# EAGLE schematic pure_midi (EAGLE 9.2.2)

## Sheet 1 of 6: CONTROLLER
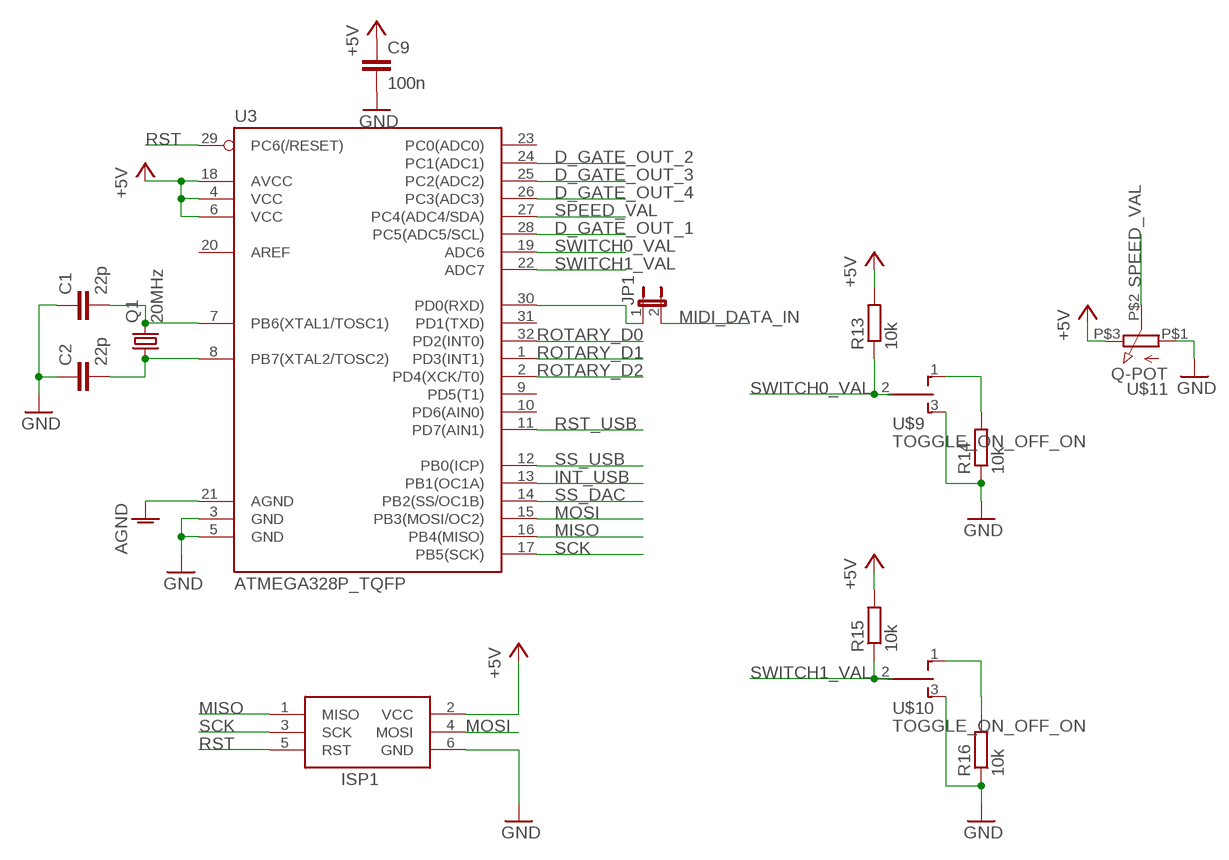
[diagram p0: schematic, sheet 1]

### Parts
C1  22p  C-EUC0805  [C0805]
C2  22p  C-EUC0805  [C0805]
C9  100n  C-EUC0805  [C0805]
ISP1  AVRISP-6  [AVRISP]
JP1  JP1E  [JP1]
Q1  20MHz  CRYSTALHC49UP  [HC49UP]
R13  10k  R-EU_R0805  [R0805]
R14  10k  R-EU_R0805  [R0805]
R15  10k  R-EU_R0805  [R0805]
R16  10k  R-EU_R0805  [R0805]
U3  ATMEGA328P_TQFP  [TQFP32-08]
U$9  TOGGLE_ON_OFF_ON  [TOGGLE_ON_OFF_ON]
U$10  TOGGLE_ON_OFF_ON  [TOGGLE_ON_OFF_ON]
U$11  Q-POT  [Q-POT]

### Nets
+5V [POWER]: C9.1 ISP1.2(VCC) R13.2 R15.2 U3.4(VCC) U3.6(VCC) U3.18(AVCC) U$11.P$3 ; also sheet 2,3,4,5,6
D_GATE_OUT_1: U3.28(PC5(ADC5/SCL)) ; also sheet 2
D_GATE_OUT_2: U3.24(PC1(ADC1)) ; also sheet 2
D_GATE_OUT_3: U3.25(PC2(ADC2)) ; also sheet 2
D_GATE_OUT_4: U3.26(PC3(ADC3)) ; also sheet 2
GND [POWER]: C1.1 C2.1 C9.2 ISP1.6(GND) R14.1 R16.1 U3.3(GND) U3.5(GND) U3.21(AGND) U$9.3(S) U$10.3(S) U$11.P$1 ; supply symbol labelled AGND ; also sheet 2,3,4,5,6
INT_USB: U3.13(PB1(OC1A)) ; also sheet 5
MIDI_DATA_IN: JP1.2 ; also sheet 3
MISO: ISP1.1(MISO) U3.16(PB4(MISO)) ; also sheet 5
MOSI: ISP1.4(MOSI) U3.15(PB3(MOSI/OC2)) ; also sheet 2,5
N$6: C1.2 Q1.2 U3.7(PB6(XTAL1/TOSC1))
N$7: C2.2 Q1.1 U3.8(PB7(XTAL2/TOSC2))
N$10: JP1.1 U3.30(PD0(RXD))
N$14: R16.2 U$10.1(O)
N$16: R14.2 U$9.1(O)
ROTARY_D0: U3.32(PD2(INT0)) ; also sheet 4
ROTARY_D1: U3.1(PD3(INT1)) ; also sheet 4
ROTARY_D2: U3.2(PD4(XCK/T0)) ; also sheet 4
RST: ISP1.5(RST) U3.29(PC6(/RESET))
RST_USB: U3.11(PD7(AIN1)) ; also sheet 5
SCK: ISP1.3(SCK) U3.17(PB5(SCK)) ; also sheet 2,5
SPEED_VAL: U3.27(PC4(ADC4/SDA)) U$11.P$2
SS_DAC: U3.14(PB2(SS/OC1B)) ; also sheet 2
SS_USB: U3.12(PB0(ICP)) ; also sheet 5
SWITCH0_VAL: R13.1 U3.19(ADC6) U$9.2(P)
SWITCH1_VAL: R15.1 U3.22(ADC7) U$10.2(P)
Unconnected: U3.9(PD5(T1)) U3.10(PD6(AIN0)) U3.20(AREF) U3.23(PC0(ADC0)) U3.31(PD1(TXD))

## Sheet 2 of 6: OUTPUT
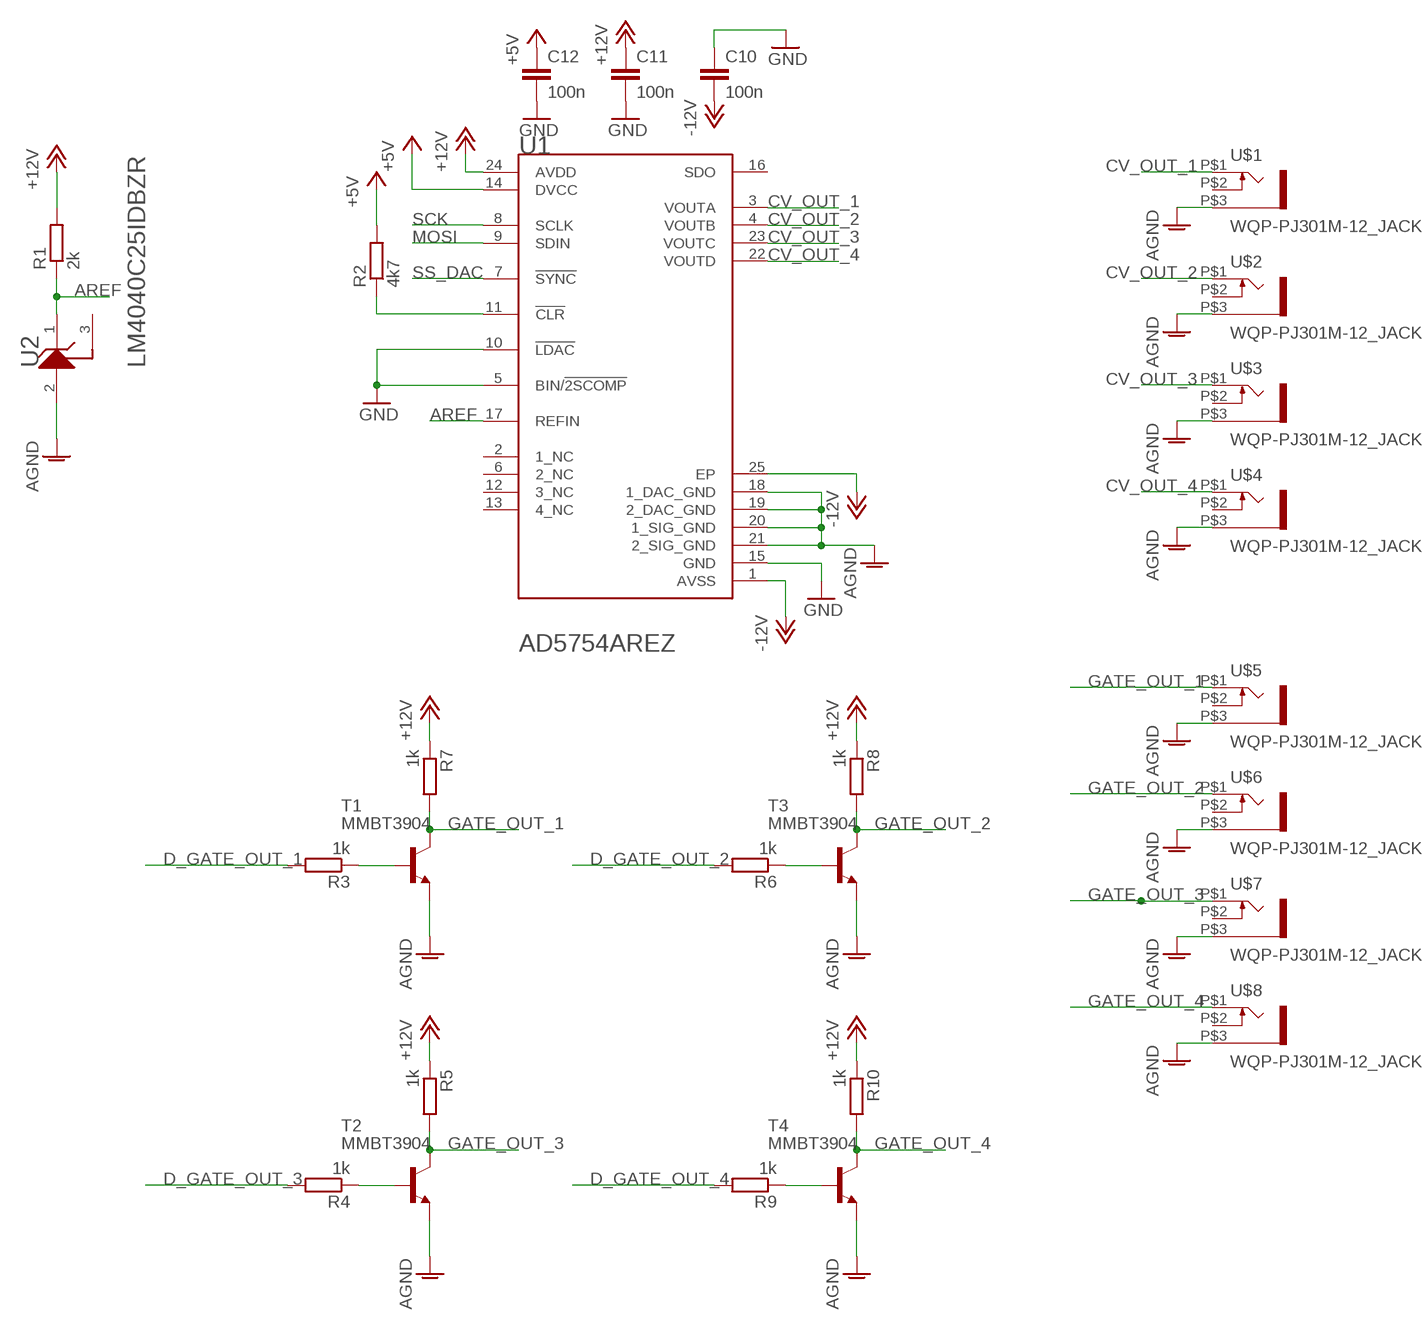
[diagram p1: schematic, sheet 2]

### Parts
C10  100n  C-EUC0805  [C0805]
C11  100n  C-EUC0805  [C0805]
C12  100n  C-EUC0805  [C0805]
R1  2k  R-EU_R0805  [R0805]
R2  4k7  R-EU_R0805  [R0805]
R3  1k  R-EU_R0805  [R0805]
R4  1k  R-EU_R0805  [R0805]
R5  1k  R-EU_R0805  [R0805]
R6  1k  R-EU_R0805  [R0805]
R7  1k  R-EU_R0805  [R0805]
R8  1k  R-EU_R0805  [R0805]
R9  1k  R-EU_R0805  [R0805]
R10  1k  R-EU_R0805  [R0805]
T1  MMBT3904  -NPN-SOT23-EBC  [SOT23-EBC]
T2  MMBT3904  -NPN-SOT23-EBC  [SOT23-EBC]
T3  MMBT3904  -NPN-SOT23-EBC  [SOT23-EBC]
T4  MMBT3904  -NPN-SOT23-EBC  [SOT23-EBC]
U1  ANALOG_DEVICES_INC_AD5754AREZANALOG_DEVICES_INC_AD5754AREZ_0_0  [ANALOG_DEVICES_INC_AD5754AREZ_0]
U2  TEXAS_INSTRUMENTS_LM4040C25IDBZRTEXAS_INSTRUMENTS_LM4040C25IDBZR_0_1  [TEXAS_INSTRUMENTS_LM4040C25IDBZR_1]
U$1  WQP-PJ301M-12_JACK  [WQP-PJ301M-12_JACK]
U$2  WQP-PJ301M-12_JACK  [WQP-PJ301M-12_JACK]
U$3  WQP-PJ301M-12_JACK  [WQP-PJ301M-12_JACK]
U$4  WQP-PJ301M-12_JACK  [WQP-PJ301M-12_JACK]
U$5  WQP-PJ301M-12_JACK  [WQP-PJ301M-12_JACK]
U$6  WQP-PJ301M-12_JACK  [WQP-PJ301M-12_JACK]
U$7  WQP-PJ301M-12_JACK  [WQP-PJ301M-12_JACK]
U$8  WQP-PJ301M-12_JACK  [WQP-PJ301M-12_JACK]

### Nets
+5V [POWER]: C12.1 R2.2 U1.14(DVCC) ; also sheet 1,3,4,5,6
+12V [POWER]: C11.1 R1.2 R5.1 R7.1 R8.1 R10.1 U1.24(AVDD) ; also sheet 6
-12V [POWER]: C10.2 U1.1(AVSS) U1.25(EP) ; also sheet 6
AREF: R1.1 U1.17(REFIN) U2.1(CATHODE)
CV_OUT_1: U1.3(VOUTA) U$1.P$1
CV_OUT_2: U1.4(VOUTB) U$2.P$1
CV_OUT_3: U1.23(VOUTC) U$3.P$1
CV_OUT_4: U1.22(VOUTD) U$4.P$1
D_GATE_OUT_1: R3.2 ; also sheet 1
D_GATE_OUT_2: R6.2 ; also sheet 1
D_GATE_OUT_3: R4.2 ; also sheet 1
D_GATE_OUT_4: R9.2 ; also sheet 1
GATE_OUT_1: R7.2 T1.C U$5.P$1
GATE_OUT_2: R8.2 T3.C U$6.P$1
GATE_OUT_3: R5.2 T2.C U$7.P$1
GATE_OUT_4: R10.2 T4.C U$8.P$1
GND [POWER]: C10.1 C11.2 C12.2 T1.E T2.E T3.E T4.E U1.5(BIN/!2SCOMP!) U1.10(!LDAC!) U1.15(GND) U1.18(1_DAC_GND) U1.19(2_DAC_GND) U1.20(1_SIG_GND) U1.21(2_SIG_GND) U2.2(ANODE) U$1.P$3 U$2.P$3 U$3.P$3 U$4.P$3 U$5.P$3 U$6.P$3 U$7.P$3 U$8.P$3 ; supply symbol labelled AGND ; also sheet 1,3,4,5,6
MOSI: U1.9(SDIN) ; also sheet 1,5
N$1: R2.1 U1.11(!CLR!)
N$2: R3.1 T1.B
N$3: R4.1 T2.B
N$8: R6.1 T3.B
N$11: R9.1 T4.B
SCK: U1.8(SCLK) ; also sheet 1,5
SS_DAC: U1.7(!SYNC!) ; also sheet 1
Unconnected: U1.2(1_NC) U1.6(2_NC) U1.12(3_NC) U1.13(4_NC) U1.16(SDO) U2.3(NC) U$1.P$2 U$2.P$2 U$3.P$2 U$4.P$2 U$5.P$2 U$6.P$2 U$7.P$2 U$8.P$2

## Sheet 3 of 6: MIDI
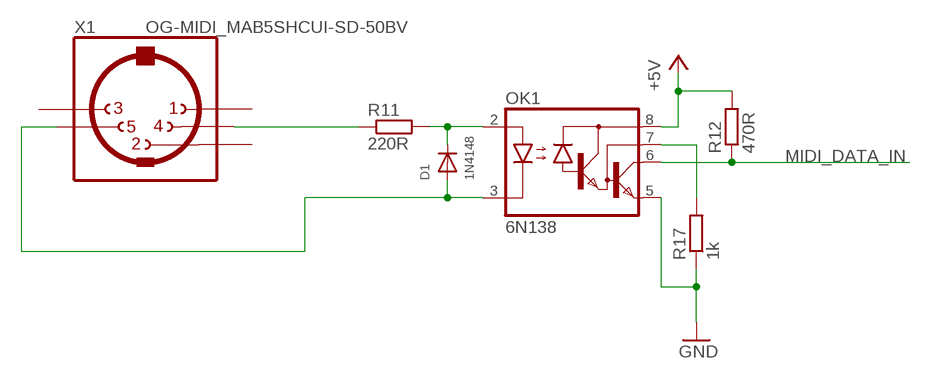
[diagram p2: schematic, sheet 3]

### Parts
D1  1N4148  DIODESOD-323F  [SOD-323F]
OK1  6N138  [DIL08]
R11  220R  R-EU_R0805  [R0805]
R12  470R  R-EU_R0805  [R0805]
R17  1k  R-EU_R0805  [R0805]
X1  OG-MIDI_MAB5SHCUI-SD-50BV  [OG-MIDI_SD-50BV]

### Nets
+5V [POWER]: OK1.8(VCC) R12.2 ; also sheet 1,2,4,5,6
GND [POWER]: OK1.5(GND) R17.1 ; also sheet 1,2,4,5,6
MIDI_DATA_IN: OK1.6(VO) R12.1 ; also sheet 1
N$4: D1.C OK1.2(A) R11.2
N$5: R11.1 X1.4
N$9: D1.A OK1.3(C) X1.5
N$12: OK1.7(VB) R17.2
Unconnected: X1.1 X1.2 X1.3

## Sheet 4 of 6: ROTARY SWITCH
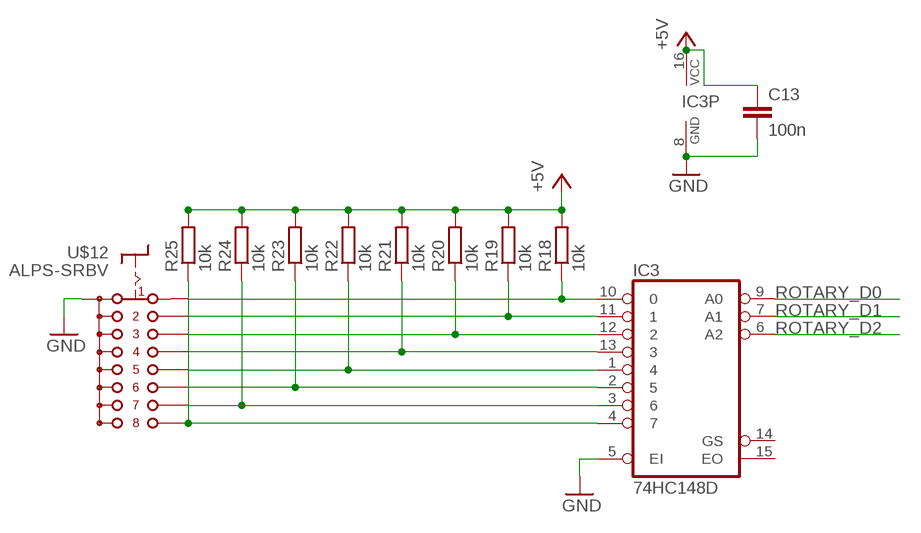
[diagram p3: schematic, sheet 4]

### Parts
C13  100n  C-EUC0805  [C0805]
IC3  74HC148D  [SO16]
R18  10k  R-EU_R0805  [R0805]
R19  10k  R-EU_R0805  [R0805]
R20  10k  R-EU_R0805  [R0805]
R21  10k  R-EU_R0805  [R0805]
R22  10k  R-EU_R0805  [R0805]
R23  10k  R-EU_R0805  [R0805]
R24  10k  R-EU_R0805  [R0805]
R25  10k  R-EU_R0805  [R0805]
U$12  ALPS-SRBV  [ALPS-SRBV]

### Nets
+5V [POWER]: C13.1 IC3.16(VCC) R18.2 R19.2 R20.2 R21.2 R22.2 R23.2 R24.2 R25.2 ; also sheet 1,2,3,5,6
GND [POWER]: C13.2 IC3.5(EI) IC3.8(GND) U$12.COM2(A) U$12.COM(A) ; also sheet 1,2,3,5,6
N$15: IC3.10 R18.1 U$12.A
N$26: IC3.11 R19.1 U$12.B
N$27: IC3.12 R20.1 U$12.C
N$28: IC3.13 R21.1 U$12.D
N$29: IC3.1 R22.1 U$12.E
N$30: IC3.2 R23.1 U$12.F
N$31: IC3.3 R24.1 U$12.G
N$32: IC3.4 R25.1 U$12.H
ROTARY_D0: IC3.9(A0) ; also sheet 1
ROTARY_D1: IC3.7(A1) ; also sheet 1
ROTARY_D2: IC3.6(A2) ; also sheet 1
Unconnected: IC3.14(GS) IC3.15(EO)

## Sheet 5 of 6: USB
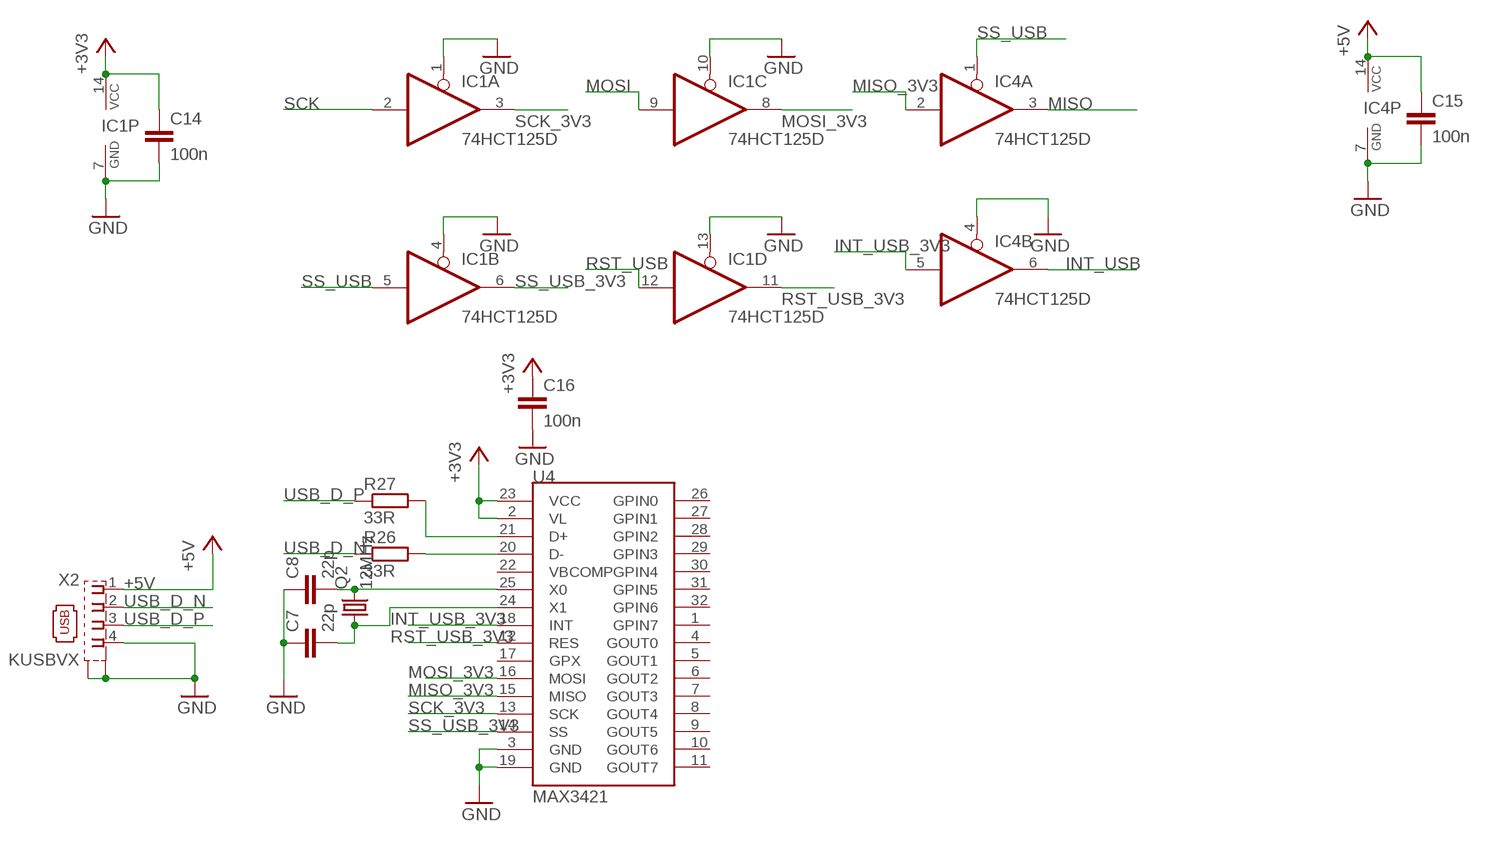
[diagram p4: schematic, sheet 5]

### Parts
C7  22p  C-EUC0805  [C0805]
C8  22p  C-EUC0805  [C0805]
C14  100n  C-EUC0805  [C0805]
C15  100n  C-EUC0805  [C0805]
C16  100n  C-EUC0805  [C0805]
IC1  74HCT125D  [SO14]
IC4  74HCT125D  [SO14]
Q2  12MHz  CRYSTALHC49UP  [HC49UP]
R26  33R  R-EU_R0805  [R0805]
R27  33R  R-EU_R0805  [R0805]
U4  MAX3421  MAX3421ESMD  [TQFP32-5MM]
X2  KUSBVX  [KUSBVX]

### Nets
+3V3: C14.1 C16.1 IC1.14(P:VCC) U4.2(VL) U4.23(VCC) ; also sheet 6
+5V [POWER]: C15.1 IC4.14(P:VCC) X2.1 ; also sheet 1,2,3,4,6
GND [POWER]: C7.1 C8.1 C14.2 C15.2 C16.2 IC1.1(A:OE) IC1.4(B:OE) IC1.7(P:GND) IC1.10(C:OE) IC1.13(D:OE) IC4.4(B:OE) IC4.7(P:GND) U4.3(GND) U4.19(GND) X2.4 X2.M1(S1) X2.M2(S2) ; also sheet 1,2,3,4,6
INT_USB: IC4.6(B:O) ; also sheet 1
INT_USB_3V3: IC4.5(B:I) U4.18(INT)
MISO: IC4.3(A:O) ; also sheet 1
MISO_3V3: IC4.2(A:I) U4.15(MISO)
MOSI: IC1.9(C:I) ; also sheet 1,2
MOSI_3V3: IC1.8(C:O) U4.16(MOSI)
N$19: C8.2 Q2.2 U4.25(X0)
N$25: C7.2 Q2.1 U4.24(X1)
RST_USB: IC1.12(D:I) ; also sheet 1
RST_USB_3V3: IC1.11(D:O) U4.12(RES)
SCK: IC1.2(A:I) ; also sheet 1,2
SCK_3V3: IC1.3(A:O) U4.13(SCK)
SS_USB: IC1.5(B:I) IC4.1(A:OE) ; also sheet 1
SS_USB_3V3: IC1.6(B:O) U4.14(SS)
USB_D_N: R26.1 X2.2
USB_D_P: R27.1 X2.3
USB_N: R26.2 U4.20(D-)
USB_P: R27.2 U4.21(D+)
Unconnected: IC4.8(C:O) IC4.9(C:I) IC4.10(C:OE) IC4.11(D:O) IC4.12(D:I) IC4.13(D:OE) U4.1(GPIN7) U4.4(GOUT0) U4.5(GOUT1) U4.6(GOUT2) U4.7(GOUT3) U4.8(GOUT4) U4.9(GOUT5) U4.10(GOUT6) U4.11(GOUT7) U4.17(GPX) U4.22(VBCOMP) U4.26(GPIN0) U4.27(GPIN1) U4.28(GPIN2) U4.29(GPIN3) U4.30(GPIN4) U4.31(GPIN5) U4.32(GPIN6)

## Sheet 6 of 6: POWER
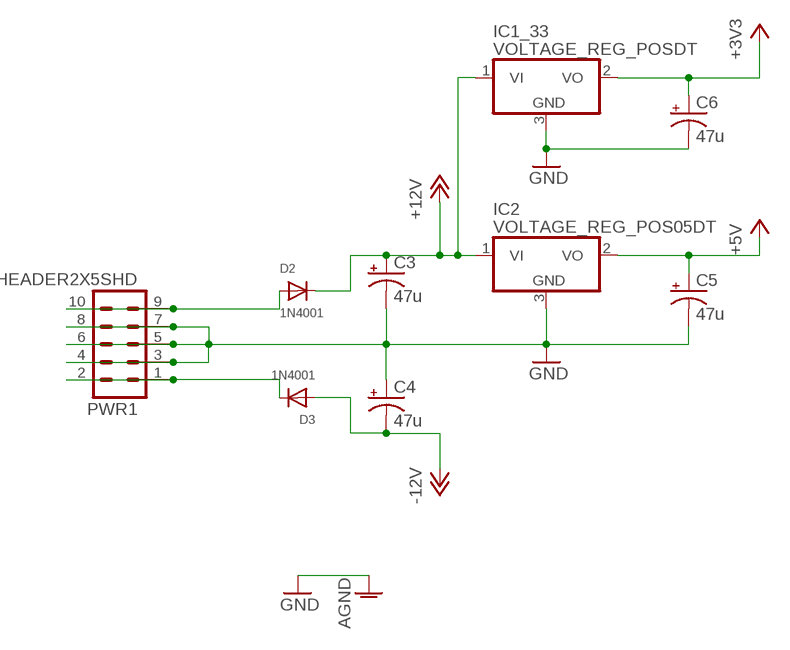
[diagram p5: schematic, sheet 6]

### Parts
C3  47u  CAPACITOR_POL-US153CLV-0505  [153CLV-0505]
C4  47u  CAPACITOR_POL-US153CLV-0505  [153CLV-0505]
C5  47u  CAPACITOR_POL-US153CLV-0505  [153CLV-0505]
C6  47u  CAPACITOR_POL-US153CLV-0505  [153CLV-0505]
D2  1N4001  DIODESMA  [SMADIODE]
D3  1N4001  DIODESMA  [SMADIODE]
IC1_33  VOLTAGE_REG_POSDT  [TO252]
IC2  VOLTAGE_REG_POS05DT  [TO252]
PWR1  HEADER2X5SHD  [2X5-SHROUDED]

### Nets
+3V3: C6.+ IC1_33.2(VO) ; also sheet 5
+5V [POWER]: C5.+ IC2.2(VO) ; also sheet 1,2,3,4,5
+12V [POWER]: C3.+ D2.C IC1_33.1(VI) IC2.1(VI) ; also sheet 2
-12V [POWER]: C4.- D3.A ; also sheet 2
GND [POWER]: C3.- C4.+ C5.- C6.- IC1_33.3(GND) IC2.3(GND) PWR1.3 PWR1.4 PWR1.5 PWR1.6 PWR1.7 PWR1.8 ; supply symbol labelled AGND ; also sheet 1,2,3,4,5
N$13: D2.A PWR1.9 PWR1.10
N$20: D3.C PWR1.1 PWR1.2

## Library data of the parts
C1 C2 C7-C16 = rcl:C-EU: CAPACITOR, European symbol; SPICEPREFIX: C
C3-C6 = GMSN:CAPACITOR_POL-US: POLARIZED CAPACITOR, American symbol
D1 = adafruit:DIODE: Diode SMADIODE - SMA Surface Mount Package 20V 1A Schottky Diode Digikey: 641-1014-6-ND DO-1N4148 - Through Hole Small Current Diode SOD-123 20V 1 A (.5mV Vf) Schottky Diode - Digikey: MBRX120TPMSCT-ND SOD-323 10V 570mA (.38mV Vf, 3ns) Schottky Diode - Digikey: ZLLS410CT-ND SOD-523 30V 30mA Schottky Diode (RB751S-40TE61) - Digikey: RB751S-40TE61CT-ND SOT23-R/W - SOT23 Package (R = Solder Paste/Reflow Ovens, W = Hand-Soldering) BAT54Film 40V 300mA - Digikey: 497-7162-1-ND
D2 D3 = GMSN:DIODE: Diode SMADIODE - SMA Surface Mount Package 20V 1A Schottky Diode Digikey: 641-1014-6-ND DO-1N4148 - Through Hole Small Current Diode SOD-123 20V 1 A (.5mV Vf) Schottky Diode - Digikey: MBRX120TPMSCT-ND SOD-323 10V 570mA (.38mV Vf, 3ns) Schottky Diode - Digikey: ZLLS410CT-ND SOD-523 30V 30mA Schottky Diode (RB751S-40TE61) - Digikey: RB751S-40TE61CT-ND SOT23-R/W - SOT23 Package (R = Solder Paste/Reflow Ovens, W = Hand-Soldering) BAT54Film 40V 300mA - Digikey: 497-7162-1-ND
IC1 IC4 = 74xx-eu:74*125: Quad bus BUFFER, 3-state
IC1_33 IC2 = GMSN:VOLTAGE_REG_POS: Positive VOLTAGE REGULATOR Added bigger pads to the TO-92 package
IC3 = 74xx-eu:74*148: 10-line to 4-line and 8-line to 3-line PRIORITY ENCODER
ISP1 = adafruit:AVRISP: AVR ISP HEADER Standard 6 pin header for AVR programming
JP1 = jumper:JP1E: JUMPER
OK1 = optocoupler:6N138: MOTOROLA OPTO COUPLER; MF: VISHAY/TELEFUNKEN; MPN: 6N138; OC_FARNELL: 9860150; OC_NEWARK: 35K5294
PWR1 = GMSN:HEADER2X5: Header 5x2 Standard 10-pin dual row 0.1" header. Commonly used with AVR-ISP. Use with Spark Fun Electronics SKU: PRT-00778
Q1 Q2 = adafruit:CRYSTAL: CRYSTAL; OC_FARNELL: unknown; OC_NEWARK: unknown
R1-R10 R18-R27 = rcl:R-EU_: RESISTOR, European symbol; SPICEPREFIX: R
R11-R17 = resistor:R-EU_: RESISTOR, European symbol
T1-T4 = transistor:*-NPN-: NPN Transistror BF959 corrected 2008.03.06
U1 = Analog Devices Inc - AD5754AREZ:ANALOG_DEVICES_INC_AD5754AREZ: DAC 4-CH Resistor-String 16-bit 24-Pin TSSOP EP; AMBIENT_TEMPERATURE_RANGE_HIGH: +85°C; AMBIENT_TEMPERATURE_RANGE_LOW: -40°C; CENTROID_NOT_SPECIFIED: No; DATASHEET: http://www.analog.com/media/en/technical-documentation/data-sheets/AD5724_5734_5754.pdf; DATA_POLARITY: Unipolar/Bipolar; DEVICE_CLASS_L1: Integrated Circuits (ICs); DEVICE_CLASS_L2: Data Converter ICs; DEVICE_CLASS_L3: Digital to Analog Converters (DACs); DIGIKEY_DESCRIPTION: IC DAC 16BIT DSP/SRL 24TSSOP; DIGIKEY_PART_NUMBER: AD5754AREZ-ND; FOOTPRINT_PARAMETERS_0: {"fp_type":"TSSOP2","params":{"N":{"nom":24,"long name":"Number of leads","min":null,"max":null,"short name":"N","type":"count"},"A":{"nom":false,"long name":"Height","min":false,"max":1200000,"short name":"A","type":"measurement"},"A1":{"nom":false,"long name":"Package clearance","min":50000,"max":150000,"short name":"A1","type":"measurement"},"A2":{"nom":1000000,"long name":"Package height","min":800000,"max":1050000,"short name":"A2","type":"measurement"},"D":{"nom":7800000,"long name":"Package length","min":7700000,"max":7900000,"short name":"D","type":"measurement"},"E":{"nom":6400000,"long name":"Width /w leads","min":false,"max":false,"short name":"E","type":"measurement"},"E1":{"nom":4400000,"long name":"Package width","min":4300000,"max":4500000,"short name":"E1","type":"measurement"},"B":{"nom":false,"long name":"Lead width","min":190000,"max":300000,"short name":"B","type":"measurement"},"C":{"nom":false,"long name":"Lead thickness","min":90000,"max":200000,"short name":"C","type":"measurement"},"L":{"nom":600000,"long name":"Lead foot length","min":450000,"max":750000,"short name":"L","type":"measurement"},"e":{"nom":650000,"long name":"Lead pitch","min":null,"max":null,"short name":"e","type":"measurement"},"PHI":{"nom":false,"long name":"Lead angle","min":0,"max":8,"short name":"PHI","type":"measurement"},"D2":{"nom":5000000,"long name":"Thermal pad length","min":4950000,"max":5020000,"short name":"D2","type":"measurement"},"E2":{"nom":3200000,"long name":"Thermal pad width","min":3150000,"max":3250000,"short name":"E2","type":"measurement"},"PC":{"long name":"Paste coverage (%)","type":"percentage","short name":"PC","value":40},"HT":{"default":"Yes","long name":"Thermal pad","type":"multichoiceparent","short name":"HT","children":["D2","E2","PC"]},"offset x":{"nom":0,"long name":"X Center offset","min":null,"max":null,"short name":"offset x","type":"measurement"},"offset y":{"nom":0,"long name":"Y Center offset","min":null,"max":null,"short name":"offset y","type":"measurement"},"LS":{"default":"Rounded rectangle","long name":"Land shape","type":"multichoice","short name":"LS"},"LS1":{"default":"Rectangle","long name":"Land shape (Pin 1)","type":"multichoice","short name":"LS1"},"solder toe":{"nom":150000,"long name":"Solder fillet (toe)","min":null,"max":null,"short name":"solder toe","type":"fixedmeasurement"},"solder heel":{"nom":250000,"long name":"Solder fillet (heel)","min":null,"max":null,"short name":"solder heel","type":"fixedmeasurement"},"solder side":{"nom":10000,"long name":"Solder fillet (side)","min":null,"max":null,"short name":"solder side","type":"fixedmeasurement"},"courtyard":{"nom":100000,"long name":"Courtyard","min":null,"max":null,"short name":"courtyard","type":"fixedmeasurement"},"SF":{"default":"C","long name":"Packing level","type":"multichoiceparent","short name":"SF","help":"http://support.upverter.com/customer/portal/articles/978783-what-is-a-footprint-packing-level","children":["solder toe","solder heel","solder side","courtyard"]}}}; HEIGHT: 1.2mm; INTERFACE: SPI,Other; IPC_LAND_PATTERN_NAME: SOP65P640X120-24; LEAD_FREE: yes; MAX_JUNCTION_TEMP: +150°C; MAX_SUPPLY_VOLTAGE: 16.5V; MF: Analog Devices Inc; MFG_PACKAGE_IDENT: RE-24; MFG_PACKAGE_IDENT_DATE: 0; MFG_PACKAGE_IDENT_REV: A; MIN_SUPPLY_VOLTAGE: 2.7V; MOUSER_DESCRIPTION: Digital to Analog Converters - DAC IC Dual 16-Bit VOut; MOUSER_PART_NUMBER: 584-AD5754AREZ; MPN: AD5754AREZ; NUMBER_OF_CHANNELS: 4; NUMBER_OF_CONVERTERS: 4; PACKAGE: TSSOP24; PIN_0_0_7_INSIDE_EDGE: clock; PREFIX: U; RESOLUTION: 16b; ROHS: yes; STANDOFF_HEIGHT: 0.05mm; TEMPERATURE_RANGE_HIGH: +85°C; TEMPERATURE_RANGE_LOW: -40°C; VERIFICATION_VERSION: 0.0.0.1
U2 = Texas Instruments - LM4040C25IDBZR:TEXAS_INSTRUMENTS_LM4040C25IDBZR: TI-LM4040C25DBZ3; CIIVA_IDS: 1469524; CODE__JEDEC: TO-236; COMPONENT_LINK_1_DESCRIPTION: Manufacturer URL; COMPONENT_LINK_1_URL: http://www.ti.com/; COMPONENT_LINK_3_DESCRIPTION: Package Specification; COMPONENT_LINK_3_URL: http://www.ti.com/litv/pdf/mpds108a; DATASHEET: http://www.ti.com/general/docs/lit/getliterature.tsp?genericPartNumber=LM4040C25&fileType=pdf; DATASHEET_VERSION: SLOS456K; FOOTPRINT_VARIANT_NAME_0: Level C; FOOTPRINT_VARIANT_NAME_1: Level B; FOOTPRINT_VARIANT_NAME_2: Level A; IMPORTED: yes; IMPORTED_FROM: vault; IMPORT_TS: 1521848919; INITIAL_ACCURACY__25DEG_C: 0.5; IOUT_IZ_MAXM_A: 15; MF: Texas Instruments; MIN_IZ_FOR_REGULATIONUA: 75; MOUNTING_TECHNOLOGY: Surface Mount; MPN: LM4040C25IDBZR; PACKAGE: DBZ0003A; PACKAGE_DESCRIPTION: 3-Pin Plastic Small Outline, Body 2.92 x 1.3 mm, Pitch 0.95 mm; PACKAGE_VERSION: 4203227/B; PREFIX: U; RATING: Catalog; RELEASE_DATE: 1464596443; ROHS: Yes; SUB_FAMILY: Shunt Voltage Reference; TEMP_COEFFMAXPPM_DEGREE_C: 100; TEMP_COEFFTYPPPM_DEGREE_C: 15; VAULT_GUID: 5413DB6E-9D10-4027-A969-08E6820F4111; VAULT_REVISION: C65482E3-4B49-4B9C-954A-31B6BAF04754; VO_V: 2.5
U3 = SparkFun-IC-Microcontroller:ATMEGA328P_TQFP: Popular 328P in QFP Storefront component: ATmega328 - TQFP <https://www.sparkfun.com/products/13448> (COM-13448) Datasheet <http://www.sparkfun.com/datasheets/Components/SMD/ATMega328.pdf> SparkFun Products SparkFun RedBoard - Programmed with Arduino <https://www.sparkfun.com/products/12757> (DEV-12757) Arduino Pro Mini 328 - 5V/16MHz <https://www.sparkfun.com/products/11113> (DEV-11113) Arduino Pro Mini 328 - 3.3V/8MHz <https://www.sparkfun.com/products/11114> (DEV-11114) SparkFun OpenLog <https://www.sparkfun.com/products/13712> (DEV-13712) SparkFun MicroView - OLED Arduino Module <https://www.sparkfun.com/products/12923> (DEV-12923) SparkFun Digital Sandbox <https://www.sparkfun.com/products/12651> (DEV-12651) SparkFun PicoBoard <https://www.sparkfun.com/products/11888> (WIG-11888) Arduino Fio <https://www.sparkfun.com/products/10116> (DEV-10116) LilyPad Arduino 328 Main Board <https://www.sparkfun.com/products/13342> (DEV-13342) SparkFun RedStick <https://www.sparkfun.com/products/13741> (DEV-13741) LilyPad MP3 <https://www.sparkfun.com/products/11013> (DEV-11013) LilyPad Arduino SimpleSnap <https://www.sparkfun.com/products/10941> (DEV-10941) SparkFun Stepoko <https://www.sparkfun.com/products/13899> (ROB-13899) SparkFun Geiger Counter <https://www.sparkfun.com/products/11345> (SEN-11345) SparkFun EL Sequencer <https://www.sparkfun.com/products/12781> (COM-12781) Arduino Pro 328 - 5V/16MHz <https://www.sparkfun.com/products/10915> (DEV-10915) CryptoCape <https://www.sparkfun.com/products/12773> (DEV-12773) SparkFun IR Thermometer Evaluation Board - MLX90614 <https://www.sparkfun.com/products/10740> (SEN-10740) SparkFun RedBot Mainboard <https://www.sparkfun.com/products/12097> (ROB-12097) Arduino Pro 328 - 3.3V/8MHz <https://www.sparkfun.com/products/10914> (DEV-10914) SparkFun Block for Intel® Edison - Arduino <https://www.sparkfun.com/products/13036> (DEV-13036) SparkFun Simon Says - Surface Mount Soldering Kit <https://www.sparkfun.com/products/10935> (KIT-10935) SparkFun 7-Segment Serial Display - Red <https://www.sparkfun.com/products/11441> (COM-11441) SparkFun 7-Segment Serial Display - White <https://www.sparkfun.com/products/11629> (COM-11629) SparkFun 7-Segment Serial Display - Yellow <https://www.sparkfun.com/products/11443> (COM-11443) SparkFun 7-Segment Serial Display - Kelly Green <https://www.sparkfun.com/products/11440> (COM-11440) SparkFun 7-Segment Serial Display - Blue <https://www.sparkfun.com/products/11442> (COM-11442) SparkFun OpenSegment Serial Display - 20mm (Blue) <https://www.sparkfun.com/products/11647> (COM-11647) SparkFun OpenSegment Serial Display - 20mm (Green) <https://www.sparkfun.com/products/11646> (COM-11646) SparkFun OpenSegment Serial Display - 20mm (White) <https://www.sparkfun.com/products/11648> (COM-11648) SparkFun OpenSegment Serial Display - 20mm (Red) <https://www.sparkfun.com/products/11644> (COM-11644) SparkFun OpenSegment Serial Display - 20mm (Yellow) <https://www.sparkfun.com/products/11645> (COM-11645) SparkFun OpenSegment Shield <https://www.sparkfun.com/products/13190> (DEV-13190); PROD_ID: IC-09069
U4 = SparkFun-IC-Comms:MAX3421E: MAX3421EEHJ USB Peripheral / Host Controller. SPI, 32TQFP SparkFun Products SparkFun USB Host Shield <https://www.sparkfun.com/products/9947> (DEV-09947); PROD_ID: IC-09517
U$1-U$8 = thonkiconn:WQP-PJ301M-12_JACK
U$9 U$10 = INSTRUO:TOGGLE_ON_OFF_ON
U$11 = INSTRUO:Q-POT
U$12 = TomW:ALPS-SRBV
X1 = yarns_v03:OG-MIDI_MAB5SH: Female CONNECTOR 5 pins 90 deg. with shield, horizontal (DIN 41524)
X2 = con-kycon:KUSBVX: Vertical,Top Entry Universal Serial Bus Connector KUSBVX Series Source: KYCON Sibalco USB vertical socket KUSBV.pdf

## Net classes
1 POWER: width 0.356 mm